# Altium schematic sheet RTC.SchDoc
size A; SheetNumber: 5; SheetTotal: 16
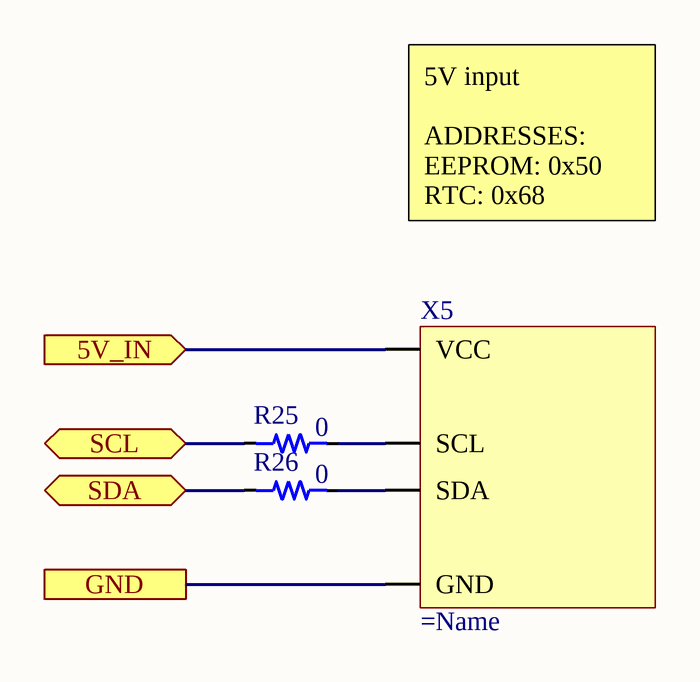
[diagram p0: RTC.SchDoc]

## Parts
R25  value 0  [0603_RES]  (hidden comment: Resistor)
R26  value 0  [0603_RES]  (hidden comment: Resistor)
X5  (no value)  [RTC Module Generic]

## Ports
5V_IN (in), GND, SCL (bidir), SDA (bidir)

## Nets
5V_IN: X5.2(VCC) ; port 5V_IN
GND: X5.1(GND) ; port GND
SCL: R25.1 ; port SCL
SDA: R26.1 ; port SDA
NetR25_2: R25.2 X5.4(SCL)
NetR26_2: R26.2 X5.3(SDA)

## Notes on the sheet
- 5V input
  ADDRESSES:
  EEPROM: 0x50
  RTC: 0x68

## Library data of the parts
X5 = RTC Module: Generic RTC module with DS3231 and AT24C32
R25 R26 = Resistor: Tolerance: *